# Altium schematic sheet step.SchDoc
size A
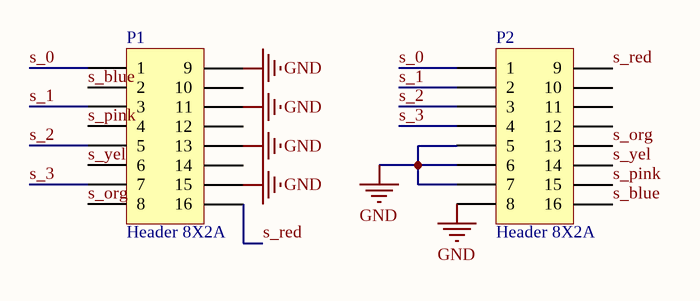
[diagram p0: step.SchDoc]

## Parts
P1  Header 8X2A  [DIP-16]
P2  Header 8X2A  [DIP-16]

## Nets
GND: P1.9 P1.11 P1.13 P1.15 P2.5 P2.6 P2.7 P2.8
s_0: P1.1 P2.1
s_1: P1.3 P2.2
s_2: P1.5 P2.3
s_3: P1.7 P2.4
s_blue: P1.2 P2.16
s_org: P1.8 P2.13
s_pink: P1.4 P2.15
s_red: P1.16 P2.9
s_yel: P1.6 P2.14

Not connected (* = marked no-connect by the designer): P1 10 12 14; P2 10 11 12

## Library data of the parts
P1 P2 = Header 8X2A: Header, 8-Pin, Dual row; LatestRevisionDate: 17-Jul-2002; LatestRevisionNote: Re-released for DXP Platform.; Publisher: Altium Limited